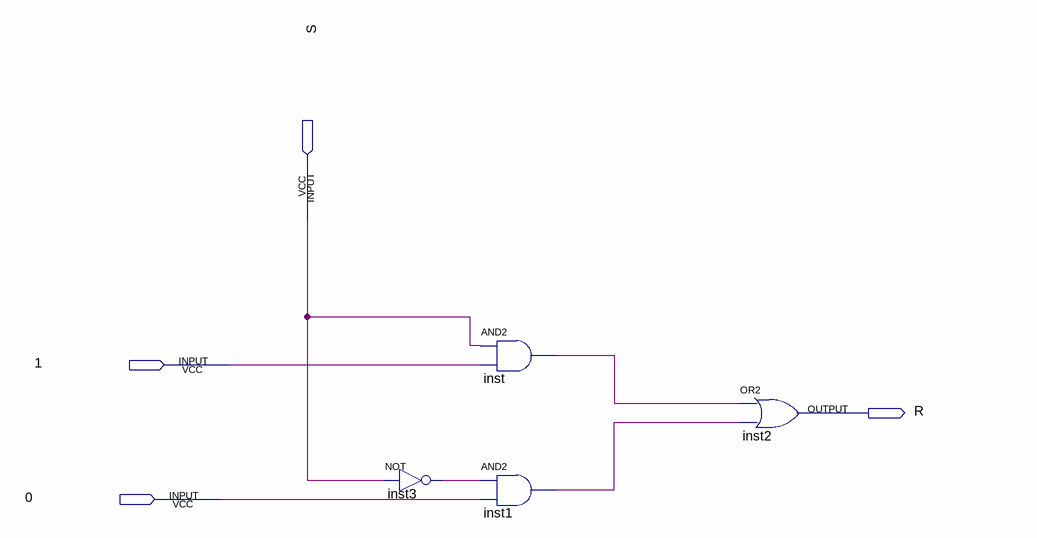
[diagram p0: schematic sheet]
// Quartus schematic mux1.bdf as structural Verilog: 4 symbols, 4 pins
module mux1 (
  input  S,
  input  \1 ,
  input  \0 ,
  output R
);

  wire inst1_out, inst3_out, inst_out;

  not inst3 (inst3_out, S);
  and inst (inst_out, S, \1 );
  and inst1 (inst1_out, inst3_out, \0 );
  // OR2 inst2 has open pins: IN1=inst_out, IN2=inst1_out, OUT=open
endmodule
